# Altium schematic sheet BoardB-Camera.SchDoc
size A; SheetNumber: 1; SheetTotal: 7
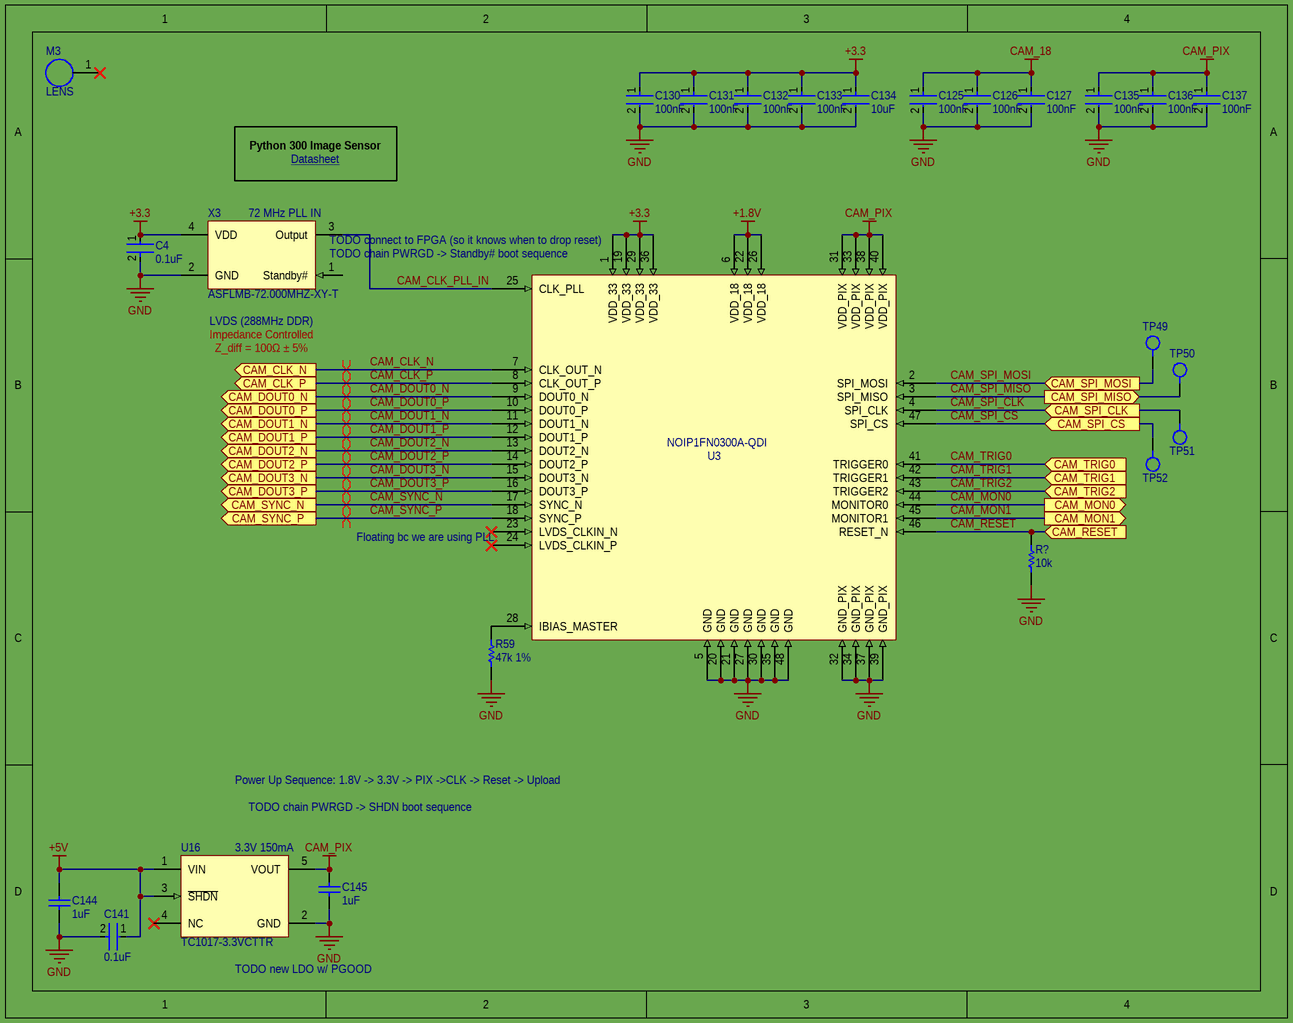
[diagram p0: BoardB-Camera.SchDoc]

## Parts
C4  0.1uF  [FP-GRM15-MFG]
C125  100nF  [FP-GRM033-0_03-MFG]
C126  100nF  [FP-GRM033-0_03-MFG]
C127  100nF  [FP-GRM033-0_03-MFG]
C130  100nF  [FP-GRM033-0_03-MFG]
C131  100nF  [FP-GRM033-0_03-MFG]
C132  100nF  [FP-GRM033-0_03-MFG]
C133  100nF  [FP-GRM033-0_03-MFG]
C134  10uF  [FP-CL05A106MP5NUNC-MFG]
C135  100nF  [FP-GRM033-0_03-MFG]
C136  100nF  [FP-GRM033-0_03-MFG]
C137  100nF  [FP-GRM033-0_03-MFG]
C141  0.1uF  [FP-GRM15-MFG]
C144  1uF  [CAPC1005X55X25LL5T10]
C145  1uF  [CAPC1005X55X25LL5T10]
M3  LENS  [LENS_MNT]
R59  47k 1%  [RESC1005X40X25NL05T05]
R?  10k  [RESC1005X40X25LL05T05]
TP49  (no value)  [TestPoint1mm]
TP50  (no value)  [TestPoint1mm]
TP51  (no value)  [TestPoint1mm]
TP52  (no value)  [TestPoint1mm]
U3  NOIP1FN0300A-QDI  [NOIP1FN0300A-QDI]
U16  TC1017-3.3VCTTR  [SOT-23-CT5_M]
X3  ASFLMB-72.000MHZ-XY-T  [ASFLMB-72.000MHZ-XY-T]

## Ports
CAM_CLK_N (out), CAM_CLK_P (out), CAM_DOUT0_N (out), CAM_DOUT0_P (out), CAM_DOUT1_N (out), CAM_DOUT1_P (out), CAM_DOUT2_N (out), CAM_DOUT2_P (out), CAM_DOUT3_N (out), CAM_DOUT3_P (out), CAM_MON0 (out), CAM_MON1 (out), CAM_RESET (in), CAM_SPI_CLK (in), CAM_SPI_CS (in), CAM_SPI_MISO (out), CAM_SPI_MOSI (in), CAM_SYNC_N (out), CAM_SYNC_P (out), CAM_TRIG0 (in), CAM_TRIG1 (in), CAM_TRIG2 (in)

## Nets
+1.8V: U3.6(VDD_18) U3.22(VDD_18) U3.26(VDD_18)
+3.3: C4.1 C130.1 C131.1 C132.1 C133.1 C134.1 U3.1(VDD_33) U3.19(VDD_33) U3.29(VDD_33) U3.36(VDD_33) X3.4(VDD)
+5V: C141.1 C144.2 U16.1(VIN) U16.3(~{SHDN})
CAM_18: C125.1 C126.1 C127.1
CAM_PIX: C135.1 C136.1 C137.1 C145.2 U3.31(VDD_PIX) U3.33(VDD_PIX) U3.38(VDD_PIX) U3.40(VDD_PIX) U16.5(VOUT)
GND: C4.2 C125.2 C126.2 C127.2 C130.2 C131.2 C132.2 C133.2 C134.2 C135.2 C136.2 C137.2 C141.2 C144.1 C145.1 R59.1 R?.1 U3.5(GND) U3.20(GND) U3.21(GND) U3.27(GND) U3.30(GND) U3.32(GND_PIX) U3.34(GND_PIX) U3.35(GND) U3.37(GND_PIX) U3.39(GND_PIX) U3.48(GND) U16.2(GND) X3.2(GND)
CAM_CLK_N: U3.7(CLK_OUT_N) ; port CAM_CLK_N
CAM_CLK_P: U3.8(CLK_OUT_P) ; port CAM_CLK_P
CAM_CLK_PLL_IN: U3.25(CLK_PLL) X3.3(Output)
CAM_DOUT0_N: U3.9(DOUT0_N) ; port CAM_DOUT0_N
CAM_DOUT0_P: U3.10(DOUT0_P) ; port CAM_DOUT0_P
CAM_DOUT1_N: U3.11(DOUT1_N) ; port CAM_DOUT1_N
CAM_DOUT1_P: U3.12(DOUT1_P) ; port CAM_DOUT1_P
CAM_DOUT2_N: U3.13(DOUT2_N) ; port CAM_DOUT2_N
CAM_DOUT2_P: U3.14(DOUT2_P) ; port CAM_DOUT2_P
CAM_DOUT3_N: U3.15(DOUT3_N) ; port CAM_DOUT3_N
CAM_DOUT3_P: U3.16(DOUT3_P) ; port CAM_DOUT3_P
CAM_MON0: U3.44(MONITOR0) ; port CAM_MON0
CAM_MON1: U3.45(MONITOR1) ; port CAM_MON1
CAM_RESET: R?.2 U3.46(RESET_N) ; port CAM_RESET
CAM_SPI_CLK: TP51.1 U3.4(SPI_CLK) ; port CAM_SPI_CLK
CAM_SPI_CS: TP52.1 U3.47(SPI_CS) ; port CAM_SPI_CS
CAM_SPI_MISO: TP50.1 U3.3(SPI_MISO) ; port CAM_SPI_MISO
CAM_SPI_MOSI: TP49.1 U3.2(SPI_MOSI) ; port CAM_SPI_MOSI
CAM_SYNC_N: U3.17(SYNC_N) ; port CAM_SYNC_N
CAM_SYNC_P: U3.18(SYNC_P) ; port CAM_SYNC_P
CAM_TRIG0: U3.41(TRIGGER0) ; port CAM_TRIG0
CAM_TRIG1: U3.42(TRIGGER1) ; port CAM_TRIG1
CAM_TRIG2: U3.43(TRIGGER2) ; port CAM_TRIG2
NetR59_2: R59.2 U3.28(IBIAS_MASTER)

Not connected (* = marked no-connect by the designer): M3 1*; U3 23(LVDS_CLKIN_N)* 24(LVDS_CLKIN_P)*; U16 4(NC)*; X3 1(Standby#)

## Layout directives
differential pair; differential pair class CAM_CLK_OUT; rule Signal Stimulus [Kind - Single Pulse    Level - High    Start Time = 0.000    Stop Time = 1.389n    Period Time = 2.778n]: CAM_CLK_N, CAM_CLK_P
differential pair; differential pair class CAM_DOUT0; rule Signal Stimulus [Kind - Single Pulse    Level - High    Start Time = 0.000    Stop Time = 1.389n    Period Time = 2.778n]: CAM_DOUT0_N, CAM_DOUT0_P
differential pair; differential pair class CAM_DOUT1; rule Signal Stimulus [Kind - Single Pulse    Level - High    Start Time = 0.000    Stop Time = 1.389n    Period Time = 2.778n]: CAM_DOUT1_N, CAM_DOUT1_P
differential pair; differential pair class CAM_DOUT2; rule Signal Stimulus [Kind - Single Pulse    Level - High    Start Time = 0.000    Stop Time = 1.389n    Period Time = 2.778n]: CAM_DOUT2_N, CAM_DOUT2_P
differential pair; differential pair class CAM_DOUT3; rule Signal Stimulus [Kind - Single Pulse    Level - High    Start Time = 0.000    Stop Time = 1.389n    Period Time = 2.778n]: CAM_DOUT3_N, CAM_DOUT3_P
differential pair; differential pair class CAM_SYNC; rule Signal Stimulus [Kind - Single Pulse    Level - High    Start Time = 0.000    Stop Time = 1.389n    Period Time = 2.778n]: CAM_SYNC_N, CAM_SYNC_P

## Notes on the sheet
- Python 300 Image Sensor
- Datasheet <https://www.onsemi.com/pdf/datasheet/noip1sn1300a-d.pdf>
- (near X3) 72 MHz PLL IN
- TODO chain PWRGD -> Standby# boot sequence
- (near X3) TODO connect to FPGA (so it knows when to drop reset)
- (near X3) LVDS (288MHz DDR)
- Impedance Controlled
- Z_diff = 100Ω ± 5%
- (near U3) Floating bc we are using PLL
- Power Up Sequence: 1.8V -> 3.3V -> PIX ->CLK -> Reset -> Upload
- TODO chain PWRGD -> SHDN boot sequence
- (near U16) 3.3V 150mA
- (near U16) TODO new LDO w/ PGOOD

## Library data of the parts
C4 C141 = CMP-2100-03641-2: CAP CER 0.1UF 16V X7R 0402; Manufacturer Part Number: GRM155R71C104KA88D; Manufacturer: Murata; Standoff Height: 0mm; Tolerance: 10%; Voltage Rating: 16Vdc; Material: Ceramic; Capacitance: 0.10μF; Value: 0.10μF; RoHS: TRUE; Temperature Characteristic: X7R; Octopart: https://octopart.com/grm155r71c104ka88d-murata-196880; Digikey Description: CAP CER 0.1UF 16V X7R 0402; Device Class L3: Ceramic Capacitors; Height: 0.55mm; ComponentLink2Description: Datasheet; Temperature Range Low: -55°C; Ipc Land Pattern Name: CAPC10050X219; ComponentLink2URL: https://search.murata.co.jp/Ceramy/image/img/A01X/G101/ENG/GRM155R71H471KA01-01A.pdf; Device Class L1: Passive Components; Lead Free: yes; Category: Cap; Package: GRM15; Temperature: -55°C to +125°C; Device Class L2: Capacitors; Temperature Range High: +125°C; Mouser Description: 0402 0.1 uF 16V ±10 % Tolerance X7R SMT Multilayer Ceramic Capacitor
C125-C127 C130-C133 C135-C137 = CMP-06035-000062-2: Chip Multilayer Ceramic Capacitors for General Purpose, 0201, 0.10uF, X5R, 15%, 10%, 6.3V; Min Operating Temperature: -55°C; Lead Free: Lead Free; Radiation Hardening: No; Dielectric: X5R; Voltage Rating (DC): 6.3V; REACH SVHC: No SVHC; Case/Package: 0201; Voltage Rating: 6.3V; Length: 0.6mm; Max Operating Temperature: 85°C; Width: 0.012inch; Depth: 0.3mm; Material: Ceramic; Case Code (Metric): 0603; Thickness: 0.013inch; Packaging: Tape and Reel; Height: 0.3mm; Capacitance: 100nF; Weight: 6E-06oz; Package Quantity: 1; Mount: Surface Mount; Voltage: 6.3V; Case Code (Imperial): 0201; Tolerance: 10%; Termination: SMD/SMT
C134 = CMP-13271-000002-1: CAP CER 10UF 10V X5R 0402; Manufacturer Part Number: CL05A106MP5NUNC; Manufacturer: Samsung; Temperature Coefficient: 15%; Tolerance: 20%; Material: Ceramic; Octopart: https://octopart.com/cl05a106mp5nunc-samsung-22457395; Voltage Rating: 10V; RoHS: TRUE; Value: 10uF; Height: 0.7mm; Digikey Description: CAP CER 10UF 10V X5R 0402; Automotive: No; Package: CL05A106MP5NUNC; Device Class L1: Passive Components; Capacitance: 10uF; Temperature Range High: +85°C; ComponentLink2Description: Datasheet; Device Class L2: Capacitors; Temperature Characteristic: X5R; Temperature: -55°C to +85°C; ComponentLink2URL: http://www.samsungsem.com/kr/support/product-search/mlcc/__icsFiles/afieldfile/2019/05/10/19-CL05A106MP5NUNC.pdf; Device Class L3: Ceramic Capacitors; Category: Cap; Temperature Range Low: -55°C; Ipc Land Pattern Name: CAPC10050X50; Lead Free: Yes
C144 C145 = CMP-1662-00020-1: Chip Capacitor, 1 uF, +/- 10%, 6.3 V, -55 to 85 degC, 0402 (1005 Metric), RoHS, Tape and Reel; PartNumber: GRM155R60J105KE19D; Voltage Rating (DC): 3 V; Type (Capacitors): X5R; Voltage Rating: 6.3 V; ComponentLink2Description: Datasheet; ComponentLink2URL: http://psearch.en.murata.com/capacitor/product/GRM155R60J105KE19%23.pdf; Max Operating Temperature: 85 degC; Min Operating Temperature: -55 degC; Package Quantity: 10000; Mounting Technology: Surface Mount; ComponentLink1Description: Manufacturer URL; ComponentLink1URL: http://www.murata.com/; PackageDescription: 2-Pin Surface Mount Device, Body 1 x 0.5 mm; Tolerance: 10%; Case/Package: 0402; Mount: Surface Mount; Packaging: Tape and Reel; Case Code (Metric): 1005; Radiation Hardening: No; Width: 0.5 mm; Length: 1 mm; DatasheetVersion: 08/2016; Height: 0.5 mm; Capacitance: 1 uF; RoHSCompliant: true; Case Code (Imperial): 0402; REACH SVHC: No SVHC; Pins: 2
M3 = LENS_MNT
R59 = CMP-2002-01155-1: Part Number: ERJ2RKF4702X; Manufacturer: Panasonic
R? = CMP-2000-07588-1: Chip Resistor, 10 KOhm, +/- 1%, 0.1 W, -55 to 155 degC, 0402 (1005 Metric), RoHS, Tape and Reel; Manufacturer: Panasonic; Power Rating: 100mW; Voltage Rating: 50V; Resistance: 10KOhm; Case\/Package: 0402; Temperature Coefficient: 100ppm\/degreesC; RoHSCompliant: True; Lead Free: LeadFree; Package Quantity: 1; Contact Plating: Tin; Length: 1mm; Radiation Hardening: No; REACH SVHC: NoSVHC; Max Operating Temperature: 155degC; Depth: 0.5mm; Case Code (Imperial): 0402; Military Standard: Not; Package Description: 2-Pin Surface Mount Device, Body 1 x 0.5 mm; Termination: SMD/SMT; Case Code (Metric): 1005; Height: 0.35mm; Packaging: TapeandReel; Voltage Rating (DC): 50V; Package Reference: 402; Number of Pins: 2; Tolerance: 1%; Mounting Technology: SurfaceMount; Width: 0.02inch; Mount: SurfaceMount; Datasheet URL: https://industrial.panasonic.com/cdbs/www-data/pdf/RDA0000/AOA0000C304.pdf; Composition: ThickFilm; Datasheet Version: 02/2017; Manufacturer URL: http://www.panasonic.com/; Max Power Dissipation: 100mW; Number of Terminations: 2; Min Operating Temperature: -55degC
TP49-TP52 = TestPoint1mm: Test Point 1mm Diameter
U3 = NOIP1FN0300A-QDI: IC IMAGE SENSOR 0.3MP 48LCC; Manufacturer: ON Semiconductor; Operating Supply Voltage: 3.4V; Supplier 1: Avnet; Manufacturer Part Number: NOIP1FN0300A-QDI; RoHS: Yes; Category: Optoelectronics; Pricing 1: 6=58.23675, 8=57.37875, 20=56.62800, 30=55.87725, 60=55.12650, 300=53.83950, 600=53.41050 (USD); Mount: Surface Mount; Case/Package: LCC; Number of Pins: 48; Min Operating Temperature: -40°C; Max Operating Temperature: 85°C; Lead Free: Lead Free; RoHS Compliant: Yes; ComponentLink1URL: http://www.onsemi.com/pub_link/Collateral/PB_NOIP1SN1300A-D.PDF?src-supplier=Digi-Key; ComponentLink1Description: http://www.onsemi.com/pub_link/Collateral/PB_NOIP1SN1300A-D.PDF?src-supplier=Digi-Key; ComponentLink2URL: http://www.onsemi.com/pub_link/Collateral/NOIP1SN1300A-D.PDF?src-supplier=Avnet+Asia; ComponentLink2Description: http://www.onsemi.com/pub_link/Collateral/NOIP1SN1300A-D.PDF?src-supplier=Avnet+Asia; Supplier Part Number 1: NOIP1FN0300A-QDI
U16 = CMP-0136-00743-1: 150 mA, Tiny CMOS LDO with Shutdown, 5-Pin SOT-23, Extended Temperature, Tape and Reel; Code_IPC: SOT23-5; PackageVersion: revBB, Aug-2009; PackageDescription: 5-Lead Plastic Small Outline Transistor (CT) [SOT-23]; DatasheetVersion: revD, 2005; PackageReference: SOT-23-CT5
X3 = ASFLMB-72.000MHZ-XY-T: Silicon Oscillator 72MHz 15pF ±10ppm 4-Pin QFN T/R; Manufacturer: Abracon; Operating Supply Voltage: 3.6V; Max Supply Current: 16mA; Supplier 1: Mouser; Manufacturer Part Number: ASFLMB-72.000MHZ-XY-T; RoHS: Yes; Category: Oscillators; Stock 1: 318; Pricing 1: 1=3.61000, 10=3.45000, 50=3.27000, 100=2.93000, 500=2.76000, 1000=2.40000, 10000=2.40000 (USD); Mount: Surface Mount; Case/Package: SMD/SMT; Number of Pins: 4; Min Operating Temperature: -40°C; Max Operating Temperature: 105°C; Frequency: 72MHz; Load Capacitance: 15pF; Packaging: Tape and Reel; Frequency Stability: 10ppm; Termination: SMD/SMT; Series: Pure Silicon™ ASFLMB; Length: 0.197inch; Width: 0.126inch; Height: 0.035inch; Radiation Hardening: No; ComponentLink1URL: https://datasheet.ciiva.com/870/memspeedproflyerii-870042.pdf?src-supplier=Digi-Key; ComponentLink1Description: https://datasheet.ciiva.com/870/memspeedproflyerii-870042.pdf?src-supplier=Digi-Key; ComponentLink2URL: https://datasheet.ciiva.com/870/memspeedproflyerii-870043.pdf?src-supplier=Digi-Key; ComponentLink2Description: https://datasheet.ciiva.com/870/memspeedproflyerii-870043.pdf?src-supplier=Digi-Key; ComponentLink3URL: https://datasheet.ciiva.com/870/memspeedproflyerii-870044.pdf?src-supplier=Digi-Key; ComponentLink3Description: https://datasheet.ciiva.com/870/memspeedproflyerii-870044.pdf?src-supplier=Digi-Key; ComponentLink4URL: https://datasheet.ciiva.com/3178/asflmb-3178058.pdf?src-supplier=Avnet; ComponentLink4Description: https://datasheet.ciiva.com/3178/asflmb-3178058.pdf?src-supplier=Avnet; ComponentLink5URL: https://datasheet.ciiva.com/13163/asflmb-24525-13163049.pdf?src-supplier=Mouser; ComponentLink5Description: https://datasheet.ciiva.com/13163/asflmb-24525-13163049.pdf?src-supplier=Mouser; Supplier Part Number 1: 815-ASFLMB-72-XY-T